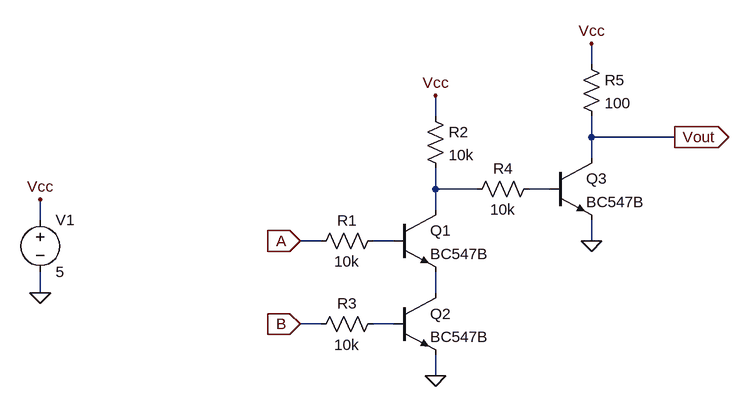
[diagram p0: schematic ANDgate.asc]
ANDgate.asc, the LTspice schematic file:
Version 4
SHEET 1 880 680
WIRE 384 -96 384 -128
WIRE 144 -16 144 -48
WIRE 384 16 384 -16
WIRE 512 16 384 16
WIRE 384 48 384 16
WIRE 144 96 144 64
WIRE 208 96 144 96
WIRE 320 96 288 96
WIRE 144 128 144 96
WIRE -464 144 -464 112
WIRE -32 176 -64 176
WIRE 80 176 48 176
WIRE 384 176 384 144
WIRE -464 256 -464 224
WIRE 144 256 144 224
WIRE -32 304 -64 304
WIRE 80 304 48 304
WIRE 144 384 144 352
FLAG -464 256 0
FLAG -464 112 Vcc
FLAG 144 -48 Vcc
FLAG 144 384 0
FLAG 384 -128 Vcc
FLAG 384 176 0
FLAG 512 16 Vout
IOPIN 512 16 Out
FLAG -64 176 A
IOPIN -64 176 In
FLAG -64 304 B
IOPIN -64 304 In
SYMBOL npn 80 128 R0
SYMATTR InstName Q1
SYMATTR Value BC547B
SYMBOL res 64 160 R90
WINDOW 0 0 56 VBottom 2
WINDOW 3 32 56 VTop 2
SYMATTR InstName R1
SYMATTR Value 10k
SYMBOL voltage -464 128 R0
WINDOW 123 0 0 Left 0
WINDOW 39 0 0 Left 0
SYMATTR InstName V1
SYMATTR Value 5
SYMBOL res 128 -32 R0
SYMATTR InstName R2
SYMATTR Value 10k
SYMBOL npn 80 256 R0
SYMATTR InstName Q2
SYMATTR Value BC547B
SYMBOL res 64 288 R90
WINDOW 0 0 56 VBottom 2
WINDOW 3 32 56 VTop 2
SYMATTR InstName R3
SYMATTR Value 10k
SYMBOL npn 320 48 R0
SYMATTR InstName Q3
SYMATTR Value BC547B
SYMBOL res 304 80 R90
WINDOW 0 0 56 VBottom 2
WINDOW 3 32 56 VTop 2
SYMATTR InstName R4
SYMATTR Value 10k
SYMBOL res 368 -112 R0
SYMATTR InstName R5
SYMATTR Value 100

The netlist it stands for:
* ANDgate.asc
Q1 N001 N003 N004 0 BC547B
R1 N003 A 10k
V1 Vcc 0 5
R2 Vcc N001 10k
Q2 N004 N005 0 0 BC547B
R3 N005 B 10k
Q3 Vout N002 0 0 BC547B
R4 N002 N001 10k
R5 Vcc Vout 100
.model NPN NPN
.model PNP PNP
.lib standard.bjt
.backanno
.end